# EAGLE design MilliToney (EAGLE 7.5.0)
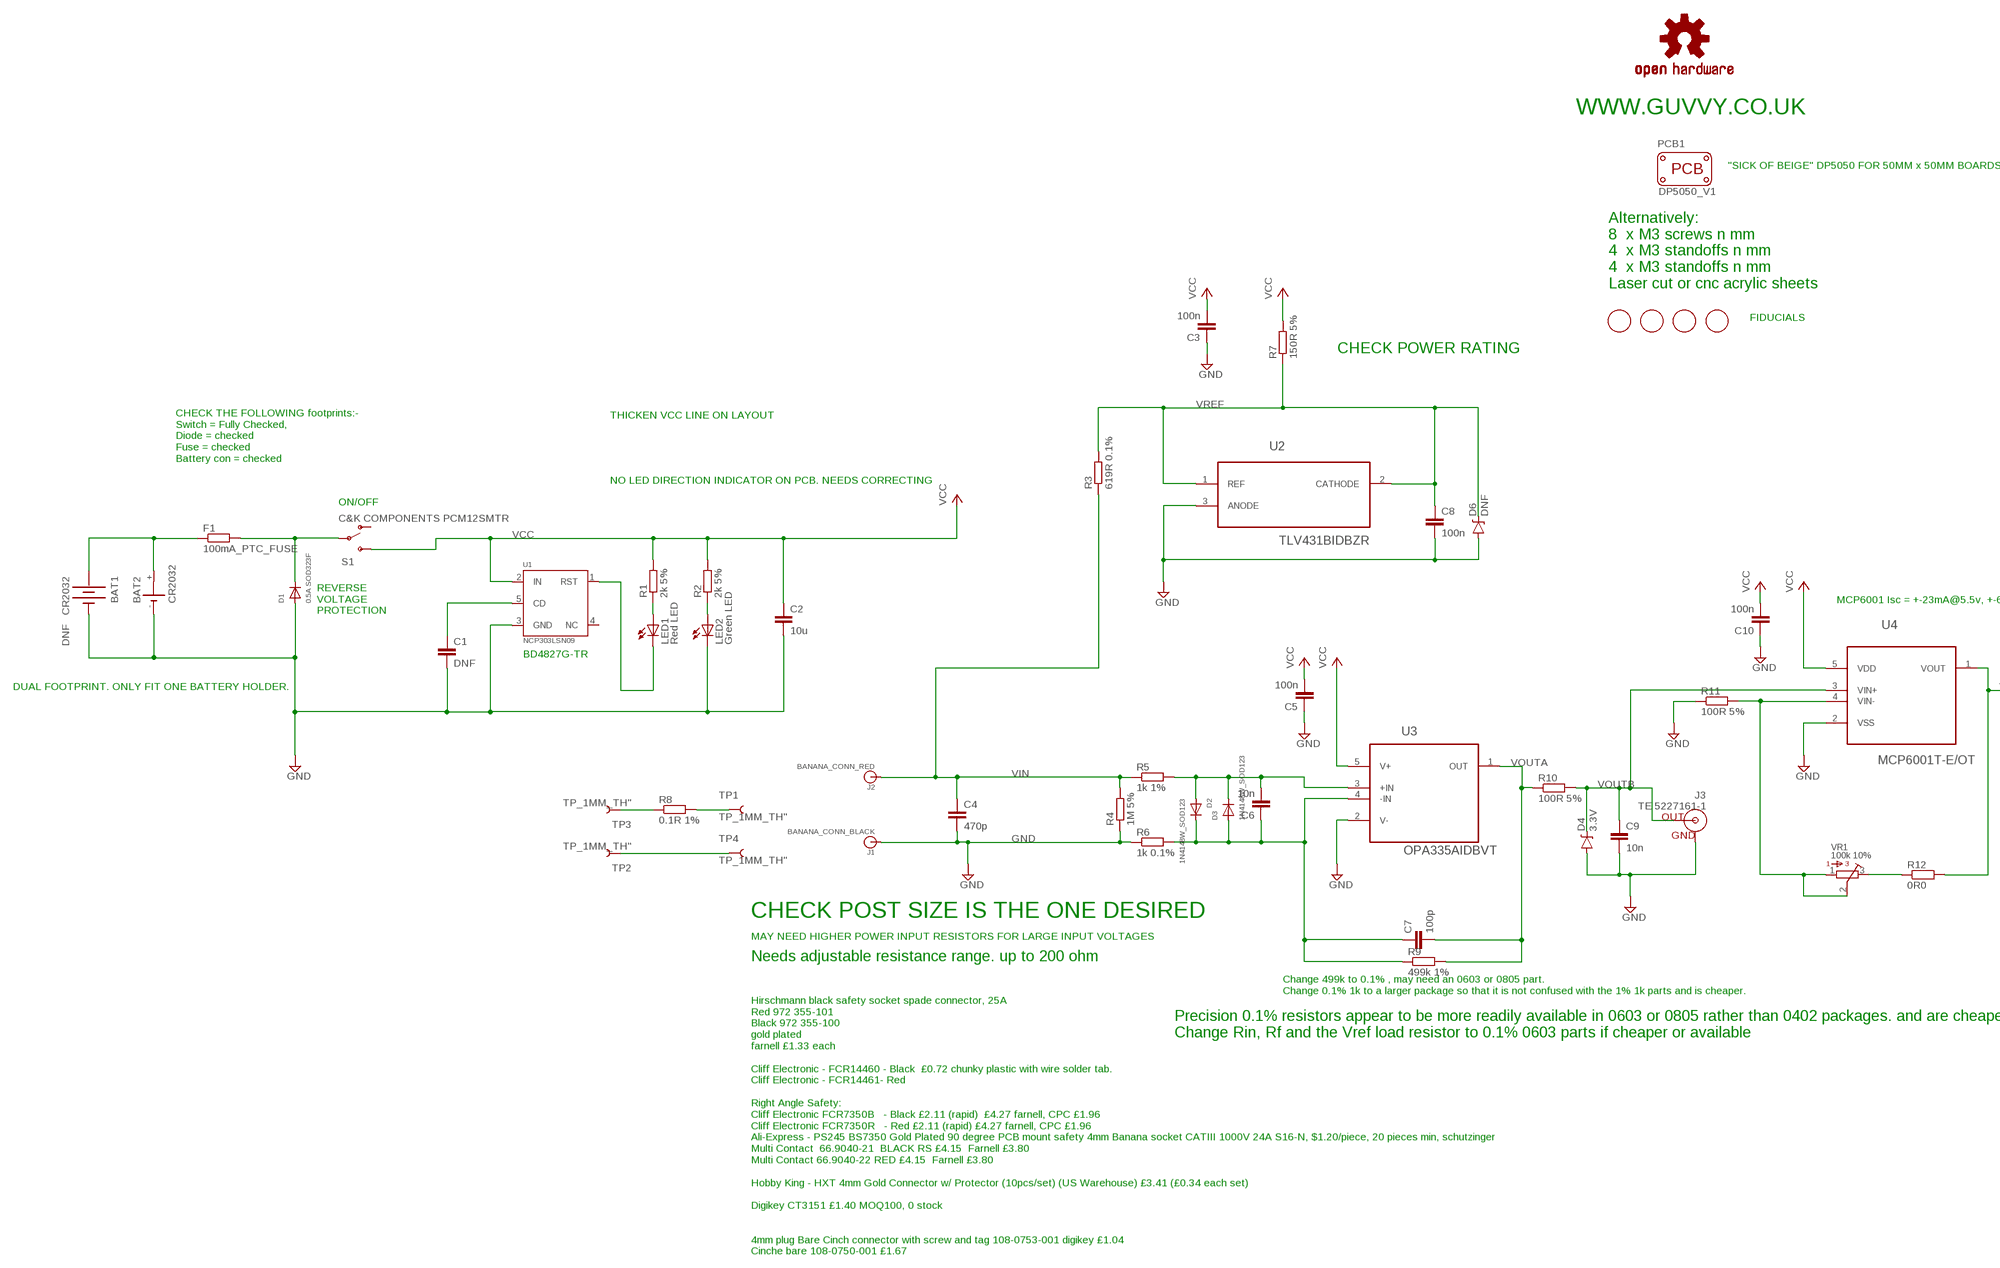
[diagram p0: schematic, sheet 1, part 1 of 2]
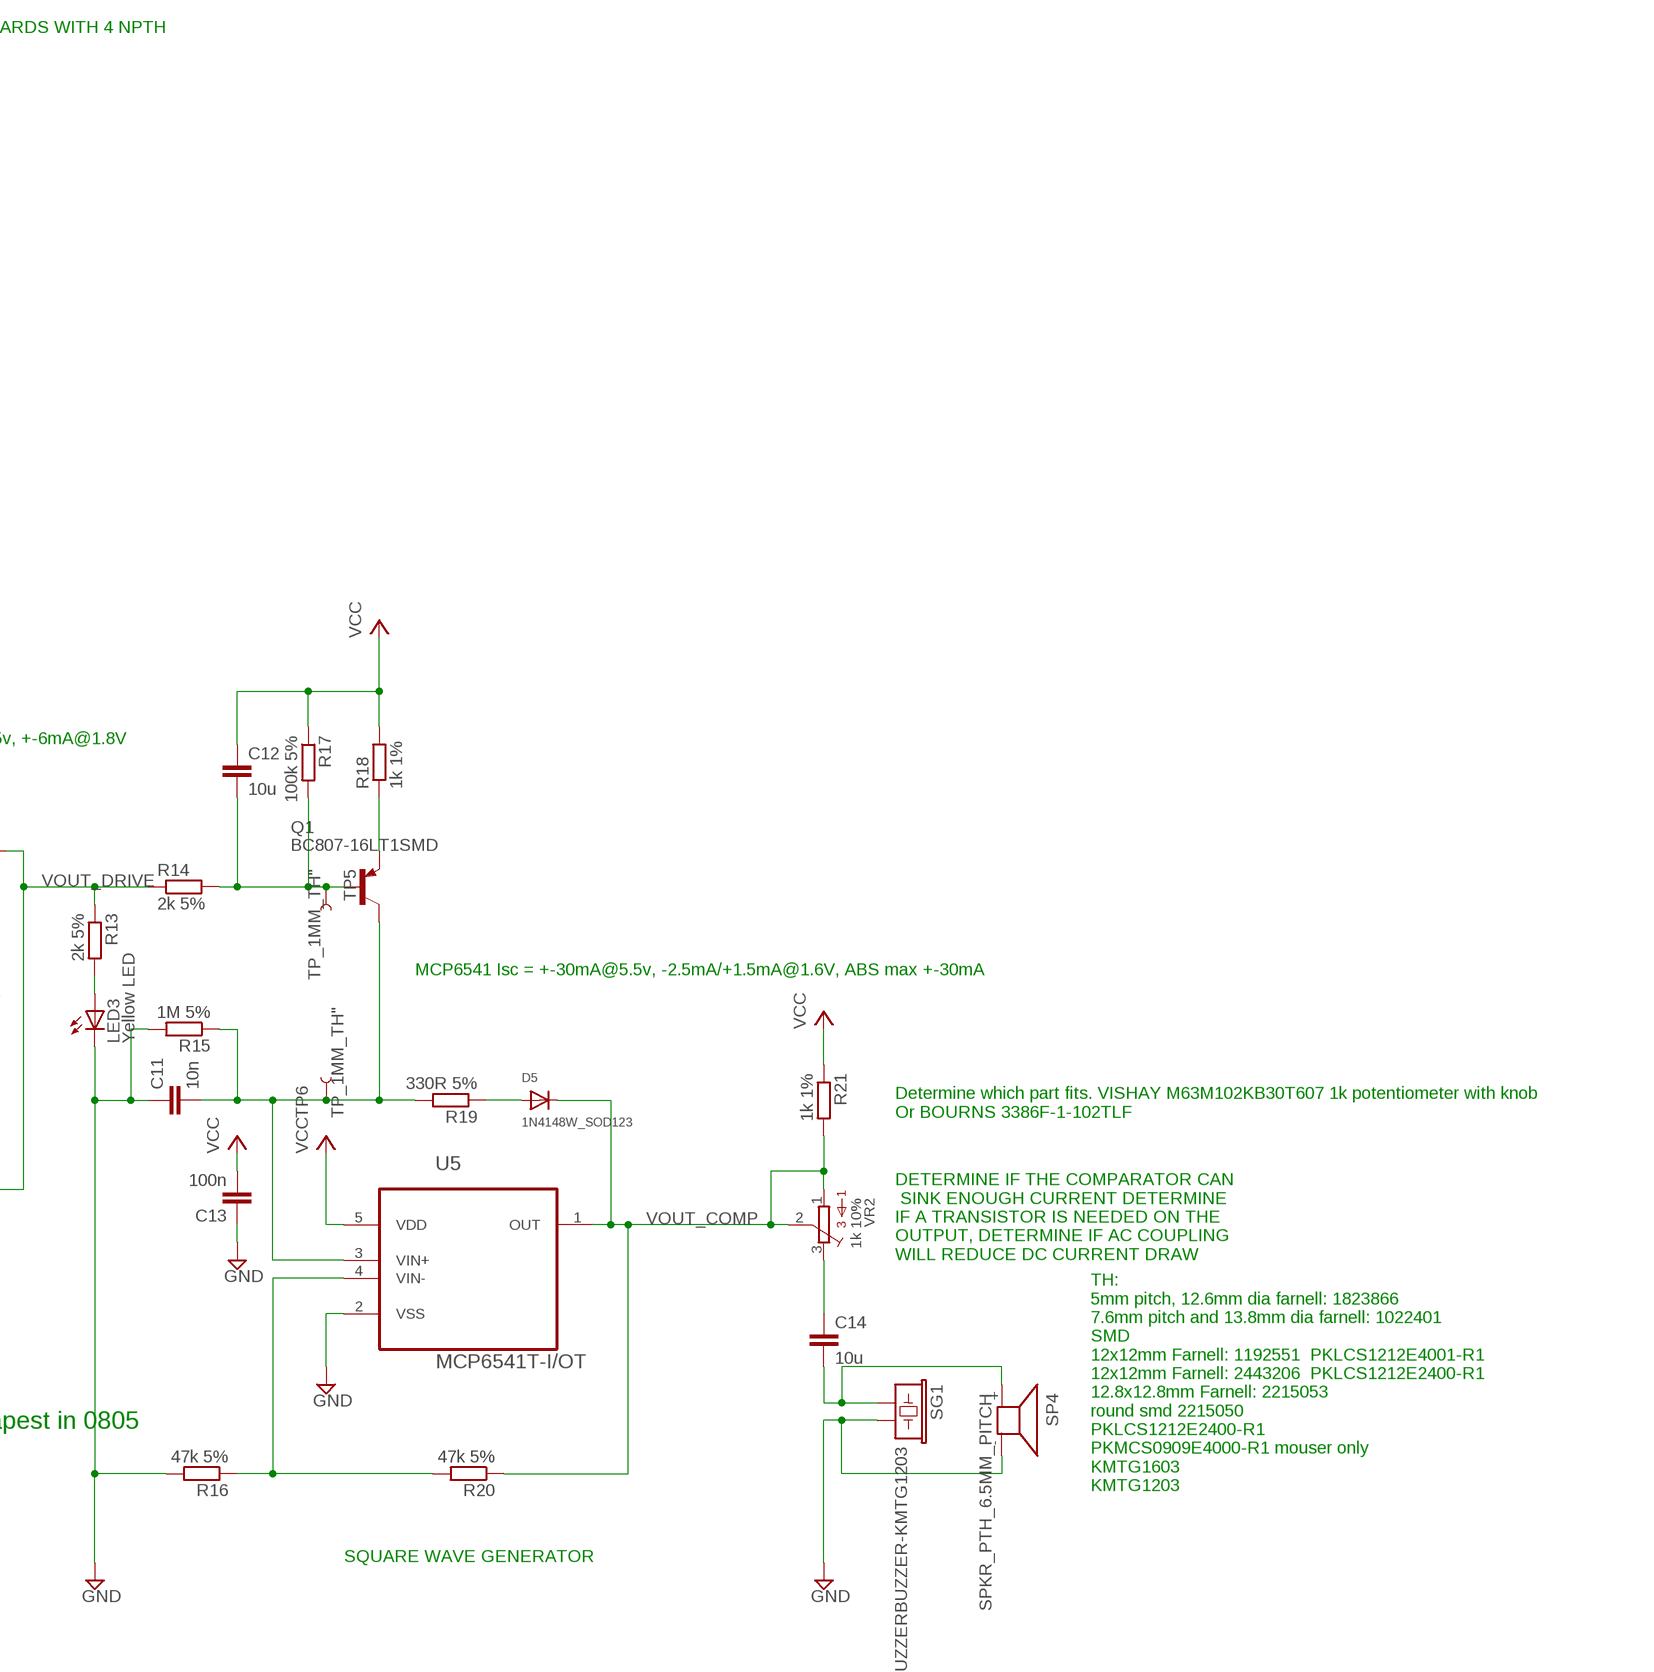
[diagram p1: schematic, sheet 1, part 2 of 2]

## Parts
BAT1  DNF CR2032  BATTERYFOB  [BATTERY_20MM_PTH_COMPACT]
BAT2  CR2032  2032  [KZH20SMD]
C1  DNF  C-EUC0402K  [C0402K]
C2  10u  C-EUC0603  [C0603]
C3  100n  C-EUC0402K  [C0402K]
C4  470p  C-EUC0402K  [C0402K]
C5  100n  C-EUC0402K  [C0402K]
C6  10n  C-EUC0402K  [C0402K]
C7  100p  C-EUC0402K  [C0402K]
C8  100n  C-EUC0402K  [C0402K]
C9  10n  C-EUC0402K  [C0402K]
C10  100n  C-EUC0402K  [C0402K]
C11  10n  C-EUC0402K  [C0402K]
C12  10u  C-EUC0603  [C0603]
C13  100n  C-EUC0402K  [C0402K]
C14  10u  C-EUC0603K  [C0603K]
D1  0.5A SOD323F  DIODESOD-323F  [SOD-323F]
D2  1N4148W_SOD123  DIODE_SOD-123FL  [SOD-123FL]
D3  1N4148W_SOD123  DIODE_SOD-123FL  [SOD-123FL]
D4  3.3V  DIODE-ZENER3.3V  [SOD-323]
D5  1N4148W_SOD123  DIODE_SOD-123FL  [SOD-123FL]
D6  DNF  DIODE-ZENER3.3V  [SOD-323]
F1  100mA_PTC_FUSE  R-EU_R0805  [R0805]
FID1  FIDUCIAL  [FIDUCIAL_1MM]
FID2  FIDUCIAL  [FIDUCIAL_1MM]
FID3  FIDUCIAL  [FIDUCIAL_1MM]
FID4  FIDUCIAL  [FIDUCIAL_1MM]
J1  BANANA_CONN_BLACK  BANANA_CONN  [BANANA_CONN]
J2  BANANA_CONN_RED  BANANA_CONN  [BANANA_CONN]
J3  TE 5227161-1  BNCPTH  [BNC]
LED1  Red LED  LEDSML0603  [SML0603]
LED2  Green LED  LEDSML0603  [SML0603]
LED3  Yellow LED  LEDSML0603  [SML0603]
LOGO1  OSHW-LOGOL  [OSHW-LOGO-L]
PCB1  PCB_DP_SQUARE-5X5  [DP5050_V1]
Q1  BC807-16LT1SMD  [SOT23-BEC]
R1  2k 5%  R-EU_R0402  [R0402]
R2  2k 5%  R-EU_R0402  [R0402]
R3  619R 0.1%  R-EU_R0402  [R0402]
R4  1M 5%  R-EU_R0402  [R0402]
R5  1k 1%  R-EU_R0402  [R0402]
R6  1k 0.1%  R-EU_R0402  [R0402]
R7  150R 5%  R-EU_R0402  [R0402]
R8  0.1R 1%  R-EU_R0603  [R0603]
R9  499k 1%  R-EU_R0402  [R0402]
R10  100R 5%  R-EU_R0402  [R0402]
R11  100R 5%  R-EU_R0402  [R0402]
R12  0R0  R-EU_R0402  [R0402]
R13  2k 5%  R-EU_R0402  [R0402]
R14  2k 5%  R-EU_R0402  [R0402]
R15  1M 5%  R-EU_R0402  [R0402]
R16  47k 5%  R-EU_R0402  [R0402]
R17  100k 5%  R-EU_R0402  [R0402]
R18  1k 1%  R-EU_R0402  [R0402]
R19  330R 5%  R-EU_R0402  [R0402]
R20  47k 5%  R-EU_R0402  [R0402]
R21  1k 1%  R-EU_R0402  [R0402]
S1  C&K COMPONENTS PCM12SMTR  SWITCH-SPDT-SMD-A  [SWITCH-SPST-SMD-A]
SG1  BUZZERBUZZER-KMTG1203  [BUZZER-KMTG1203]
SP4  SPKR_PTH_6.5MM_PITCH  KSS1201  [KSS1201]
TP1  TP_1MM_TH"  [TP_1MM_TH]
TP2  TP_1MM_TH"  [TP_1MM_TH]
TP3  TP_1MM_TH"  [TP_1MM_TH]
TP4  TP_1MM_TH"  [TP_1MM_TH]
TP5  TP_1MM_TH"  [TP_1MM_TH]
TP6  TP_1MM_TH"  [TP_1MM_TH]
U1  NCP303LSN09  [SOT23-5]
U2  TLV431BIDBZR  [SOT95P237X112-3N]
U3  OPA335AIDBVT  [SOT95P280X145-5N]
U4  MCP6001T-E/OT  [SOT95P270X145-5N]
U5  MCP6541T-I/OT  [SOT95P290X145-5N]
VR1  100k 10%  3386-F  [3386F]
VR2  1k 10%  3386-F  [3386F]

## Nets
GND: BAT1.2(-) BAT2.- C1.2 C2.2 C3.1 C4.2 C5.1 C8.2 C9.2 C10.1 C11.1 C13.1 D1.A D4.A D6.A J1.P$1 J3.GND LED2.C LED3.C R4.1 R6.1 R11.1 R15.2 R16.2 SG1.2 SP4.- U1.3(GND) U2.3(ANODE) U3.2(V-) U4.2(VSS) U5.2(VSS)
N$1: BAT1.1(+) BAT2.+ F1.1
N$3: C14.2 SG1.1 SP4.+
N$5: R8.1 TP3.P$1
N$6: C6.2 D2.A D3.C R5.2 U3.3(+IN)
N$7: TP2.P$1 TP4.P$1
N$8: D5.A R19.1
N$9: C6.1 C7.1 D2.C D3.A R6.2 R9.1 U3.4(-IN)
N$11: R12.1 VR1.3
N$14: R11.2 U4.4(VIN-) VR1.1 VR1.2
N$16: LED1.C U1.1(RST)
N$17: C12.2 Q1.B R14.2 R17.2 TP5.P$1
N$18: Q1.E R18.1
N$19: D1.C F1.2 S1.2(P)
N$20: C1.1 U1.5(CD)
N$21: R16.1 R20.2 U5.4(VIN-)
N$22: C14.1 VR2.3
N$23: LED3.A R13.2
N$24: C11.2 Q1.C R15.1 R19.2 TP6.P$1 U5.3(VIN+)
N$26: LED1.A R1.1
N$27: R8.2 TP1.P$1
N$30: LED2.A R2.1
VCC: C2.1 C3.2 C5.2 C10.2 C12.1 C13.2 R1.2 R2.2 R7.2 R17.1 R18.2 R21.1 S1.3(S) U1.2(IN) U3.5(V+) U4.5(VDD) U5.5(VDD)
VIN: C4.1 J2.P$1 R3.1 R4.2 R5.1
VOUT_COMP: D5.C R20.1 R21.2 U5.1(OUT) VR2.1 VR2.2
VOUT_DRIVE: R12.2 R13.1 R14.1 U4.1(VOUT)
VOUTA: C7.2 R9.2 R10.1 U3.1(OUT)
VOUTB: C9.1 D4.C J3.S(OUT) R10.2 U4.3(VIN+)
VREF: C8.1 D6.C R3.2 R7.1 U2.1(REF) U2.2(CATHODE)
Unconnected: S1.1(O) U1.4(NC)

## Notes on the sheet
- WWW.GUVVY.CO.UK
- "SICK OF BEIGE" DP5050 FOR 50MM x 50MM BOARDS WITH 4 NPTH
- Alternatively:
  8  x M3 screws n mm
  4  x M3 standoffs n mm
  4  x M3 standoffs n mm
  Laser cut or cnc acrylic sheets
- FIDUCIALS
- CHECK POWER RATING
- THICKEN VCC LINE ON LAYOUT
- CHECK THE FOLLOWING footprints:- 
  Switch = Fully Checked, 
  Diode = checked
  Fuse = checked
  Battery con = checked
- NO LED DIRECTION INDICATOR ON PCB. NEEDS CORRECTING
- ON/OFF
- MCP6001 Isc = +-23mA@5.5v, +-6mA@1.8V
- REVERSE
  VOLTAGE
  PROTECTION
- BD4827G-TR
- DUAL FOOTPRINT. ONLY FIT ONE BATTERY HOLDER.
- MCP6541 Isc = +-30mA@5.5v, -2.5mA/+1.5mA@1.6V, ABS max +-30mA
- Determine which part fits. VISHAY M63M102KB30T607 1k potentiometer with knob
  Or BOURNS 3386F-1-102TLF
- CHECK POST SIZE IS THE ONE DESIRED
- DETERMINE IF THE COMPARATOR CAN
   SINK ENOUGH CURRENT DETERMINE 
  IF A TRANSISTOR IS NEEDED ON THE 
  OUTPUT, DETERMINE IF AC COUPLING 
  WILL REDUCE DC CURRENT DRAW
- MAY NEED HIGHER POWER INPUT RESISTORS FOR LARGE INPUT VOLTAGES
- Needs adjustable resistance range. up to 200 ohm
- Change 499k to 0.1% , may need an 0603 or 0805 part. 
  Change 0.1% 1k to a larger package so that it is not confused with the 1% 1k parts and is cheaper.
- Precision 0.1% resistors appear to be more readily available in 0603 or 0805 rather than 0402 packages. and are cheapest in 0805
  Change Rin, Rf and the Vref load resistor to 0.1% 0603 parts if cheaper or available
- TH: 
  5mm pitch, 12.6mm dia farnell: 1823866
  7.6mm pitch and 13.8mm dia farnell: 1022401
  SMD
  12x12mm Farnell: 1192551  PKLCS1212E4001-R1
  12x12mm Farnell: 2443206  PKLCS1212E2400-R1
  12.8x12.8mm Farnell: 2215053
  round smd 2215050
  PKLCS1212E2400-R1
  PKMCS0909E4000-R1 mouser only
  KMTG1603
  KMTG1203
- SQUARE WAVE GENERATOR
- Hirschmann black safety socket spade connector, 25A
  Red 972 355-101
  Black 972 355-100
  gold plated
  farnell £1.33 each 
  
  Cliff Electronic - FCR14460 - Black  £0.72 chunky plastic with wire solder tab.
  Cliff Electronic - FCR14461- Red
  
  Right Angle Safety: 
  Cliff Electronic FCR7350B   - Black £2.11 (rapid)  £4.27 farnell, CPC £1.96
  Cliff Electronic FCR7350R   - Red £2.11 (rapid) £4.27 farnell, CPC £1.96
  Ali-Express - PS245 BS7350 Gold Plated 90 degree PCB mount safety 4mm Banana socket CATIII 1000V 24A S16-N, $1.20/piece, 20 pieces min, schutzinger
  Multi Contact  66.9040-21  BLACK RS £4.15  Farnell £3.80
  Multi Contact 66.9040-22 RED £4.15  Farnell £3.80
  
  Hobby King - HXT 4mm Gold Connector w/ Protector (10pcs/set) (US Warehouse) £3.41 (£0.34 each set) 
  
  Digikey CT3151 £1.40 MOQ100, 0 stock
  
  
  4mm plug Bare Cinch connector with screw and tag 108-0753-001 digikey £1.04
  Cinche bare 108-0750-001 £1.67

## Library data of the parts
BAT1 = SparkFun-Electromechanical:BATTERY: Battery Holders Various common sizes : AA, AAA, 18650 (PRT-12895), 20mm coin cell and 12mm coin cell. 20MM_4LEGS, BATT-10373; OC_FARNELL: unknown
BAT2 = kzh20_lithium_batterie_holder:2032; MF: RENATA; MPN: SMTU 2032-LF; OC_FARNELL: 1216354
C1 C4 C6 C7 C9 C11 = rcl:C-EU: CAPACITOR, European symbol; OC_FARNELL: unknown
C2 C12 C14 = rcl:C-EU: CAPACITOR, European symbol; MF: MURATA; MPN: GRM188R61A106ME69D; OC_FARNELL: 2456110
C3 C5 C8 C10 C13 = rcl:C-EU: CAPACITOR, European symbol; MF: MULTICOMP; MPN: MC0402X104K100CT; OC_FARNELL: 1759380
D1 = adafruit:DIODE: Diode SMADIODE - SMA Surface Mount Package 20V 1A Schottky Diode Digikey: 641-1014-6-ND DO-1N4148 - Through Hole Small Current Diode SOD-123 20V 1 A (.5mV Vf) Schottky Diode - Digikey: MBRX120TPMSCT-ND SOD-323 10V 570mA (.38mV Vf, 3ns) Schottky Diode - Digikey: ZLLS410CT-ND SOD-523 30V 30mA Schottky Diode (RB751S-40TE61) - Digikey: RB751S-40TE61CT-ND SOT23-R/W - SOT23 Package (R = Solder Paste/Reflow Ovens, W = Hand-Soldering) BAT54Film 40V 300mA - Digikey: 497-7162-1-ND; MF: NXP; MPN: PMEG3010EJ,115; OC_FARNELL: 1757770
D2 D3 D5 = adafruit:DIODE: Diode SMADIODE - SMA Surface Mount Package 20V 1A Schottky Diode Digikey: 641-1014-6-ND DO-1N4148 - Through Hole Small Current Diode SOD-123 20V 1 A (.5mV Vf) Schottky Diode - Digikey: MBRX120TPMSCT-ND SOD-323 10V 570mA (.38mV Vf, 3ns) Schottky Diode - Digikey: ZLLS410CT-ND SOD-523 30V 30mA Schottky Diode (RB751S-40TE61) - Digikey: RB751S-40TE61CT-ND SOT23-R/W - SOT23 Package (R = Solder Paste/Reflow Ovens, W = Hand-Soldering) BAT54Film 40V 300mA - Digikey: 497-7162-1-ND; MF: MULTICOMP; MPN: 1N4148W; OC_FARNELL: 1621821
D4 = SparkFun-DiscreteSemi:DIODE-ZENER: Zener Diode Production Part - 8199 3.4V Zener Voltage; OC_FARNELL: unknown; PROD_ID: DIO-11284
D6 = SparkFun-DiscreteSemi:DIODE-ZENER: Zener Diode Production Part - 8199 3.4V Zener Voltage; OC_FARNELL: unknown; PROD_ID: DIO-11284; VALUE: 3.3V
F1 = rcl:R-EU_: RESISTOR, European symbol; MF: BOURNS; MPN: MF-PSMF010X-2; OC_FARNELL: 1294873
FID1-FID4 = adafruit:FIDUCIAL: For use by pick and place machines to calibrate the vision/machine, 1mm By microbuilder.eu; OC_FARNELL: unknown
J1 = SparkFun-Connectors:BANANA_CONN: Through-hole banana jack; MF: CLIFF ELECTRONIC COMPONENTS; MPN: FCR14460; OC_FARNELL: 2392747
J2 = SparkFun-Connectors:BANANA_CONN: Through-hole banana jack; MF: CLIFF ELECTRONIC COMPONENTS; MPN: FCR14461; OC_FARNELL: 2392748
J3 = SparkFun-Connectors:BNC: BNC Connector, Mouser Part# 5227161; MF: TE CONNECTIVITY / AMP; MPN: 5227161-1; OC_FARNELL: 1338762
LED1 = led:LED: LED OSRAM: - CHIPLED LG R971, LG N971, LY N971, LG Q971, LY Q971, LO R971, LY R971 LH N974, LH R974 LS Q976, LO Q976, LY Q976 LO Q996 - Hyper CHIPLED LW Q18S LB Q993, LB Q99A, LB R99A - SideLED LS A670, LO A670, LY A670, LG A670, LP A670 LB A673, LV A673, LT A673, LW A673 LH A674 LY A675 LS A676, LA A676, LO A676, LY A676, LW A676 LS A679, LY A679, LG A679 - Hyper Micro SIDELED® LS Y876, LA Y876, LO Y876, LY Y876 LT Y87S - SmartLED LW L88C, LW L88S LB L89C, LB L89S, LG L890 LS L89K, LO L89K, LY L89K LS L896, LA L896, LO L896, LY L896 - TOPLED LS T670, LO T670, LY T670, LG T670, LP T670 LSG T670, LSP T670, LSY T670, LOP T670, LYG T670 LG T671, LOG T671, LSG T671 LB T673, LV T673, LT T673, LW T673 LH T674 LS T676, LA T676, LO T676, LY T676, LB T676, LH T676, LSB T676, LW T676 LB T67C, LV T67C, LT T67C, LS T67K, LO T67K, LY T67K, LW E67C LS E67B, LA E67B, LO E67B, LY E67B, LB E67C, LV E67C, LT E67C LW T67C LS T679, LY T679, LG T679 LS T770, LO T770, LY T770, LG T770, LP T770 LB T773, LV T773, LT T773, LW T773 LH T774 LS E675, LA E675, LY E675, LS T675 LS T776, LA T776, LO T776, LY T776, LB T776 LHGB T686 LT T68C, LB T68C - Hyper Mini TOPLED® LB M676 - Mini TOPLED Santana® LG M470 LS M47K, LO M47K, LY M47K Source: http://www.osram.convergy.de LUXEON: - LUMILED® LXK2-PW12-R00, LXK2-PW12-S00, LXK2-PW14-U00, LXK2-PW14-V00 LXK2-PM12-R00, LXK2-PM12-S00, LXK2-PM14-U00 LXK2-PE12-Q00, LXK2-PE12-R00, LXK2-PE12-S00, LXK2-PE14-T00, LXK2-PE14-U00 LXK2-PB12-K00, LXK2-PB12-L00, LXK2-PB12-M00, LXK2-PB14-N00, LXK2-PB14-P00, LXK2-PB14-Q00 LXK2-PR12-L00, LXK2-PR12-M00, LXK2-PR14-Q00, LXK2-PR14-R00 LXK2-PD12-Q00, LXK2-PD12-R00, LXK2-PD12-S00 LXK2-PH12-R00, LXK2-PH12-S00 LXK2-PL12-P00, LXK2-PL12-Q00, LXK2-PL12-R00 Source: www.luxeon.com KINGBRIGHT: KA-3528ASYC Source: www.kingbright.com; MF: KINGBRIGHT; MPN: KP-1608SURCK; OC_FARNELL: 2290329
LED2 = led:LED: LED OSRAM: - CHIPLED LG R971, LG N971, LY N971, LG Q971, LY Q971, LO R971, LY R971 LH N974, LH R974 LS Q976, LO Q976, LY Q976 LO Q996 - Hyper CHIPLED LW Q18S LB Q993, LB Q99A, LB R99A - SideLED LS A670, LO A670, LY A670, LG A670, LP A670 LB A673, LV A673, LT A673, LW A673 LH A674 LY A675 LS A676, LA A676, LO A676, LY A676, LW A676 LS A679, LY A679, LG A679 - Hyper Micro SIDELED® LS Y876, LA Y876, LO Y876, LY Y876 LT Y87S - SmartLED LW L88C, LW L88S LB L89C, LB L89S, LG L890 LS L89K, LO L89K, LY L89K LS L896, LA L896, LO L896, LY L896 - TOPLED LS T670, LO T670, LY T670, LG T670, LP T670 LSG T670, LSP T670, LSY T670, LOP T670, LYG T670 LG T671, LOG T671, LSG T671 LB T673, LV T673, LT T673, LW T673 LH T674 LS T676, LA T676, LO T676, LY T676, LB T676, LH T676, LSB T676, LW T676 LB T67C, LV T67C, LT T67C, LS T67K, LO T67K, LY T67K, LW E67C LS E67B, LA E67B, LO E67B, LY E67B, LB E67C, LV E67C, LT E67C LW T67C LS T679, LY T679, LG T679 LS T770, LO T770, LY T770, LG T770, LP T770 LB T773, LV T773, LT T773, LW T773 LH T774 LS E675, LA E675, LY E675, LS T675 LS T776, LA T776, LO T776, LY T776, LB T776 LHGB T686 LT T68C, LB T68C - Hyper Mini TOPLED® LB M676 - Mini TOPLED Santana® LG M470 LS M47K, LO M47K, LY M47K Source: http://www.osram.convergy.de LUXEON: - LUMILED® LXK2-PW12-R00, LXK2-PW12-S00, LXK2-PW14-U00, LXK2-PW14-V00 LXK2-PM12-R00, LXK2-PM12-S00, LXK2-PM14-U00 LXK2-PE12-Q00, LXK2-PE12-R00, LXK2-PE12-S00, LXK2-PE14-T00, LXK2-PE14-U00 LXK2-PB12-K00, LXK2-PB12-L00, LXK2-PB12-M00, LXK2-PB14-N00, LXK2-PB14-P00, LXK2-PB14-Q00 LXK2-PR12-L00, LXK2-PR12-M00, LXK2-PR14-Q00, LXK2-PR14-R00 LXK2-PD12-Q00, LXK2-PD12-R00, LXK2-PD12-S00 LXK2-PH12-R00, LXK2-PH12-S00 LXK2-PL12-P00, LXK2-PL12-Q00, LXK2-PL12-R00 Source: www.luxeon.com KINGBRIGHT: KA-3528ASYC Source: www.kingbright.com; MF: KINGBRIGHT; MPN: KP-1608CGCK; OC_FARNELL: 2290328
LED3 = led:LED: LED OSRAM: - CHIPLED LG R971, LG N971, LY N971, LG Q971, LY Q971, LO R971, LY R971 LH N974, LH R974 LS Q976, LO Q976, LY Q976 LO Q996 - Hyper CHIPLED LW Q18S LB Q993, LB Q99A, LB R99A - SideLED LS A670, LO A670, LY A670, LG A670, LP A670 LB A673, LV A673, LT A673, LW A673 LH A674 LY A675 LS A676, LA A676, LO A676, LY A676, LW A676 LS A679, LY A679, LG A679 - Hyper Micro SIDELED® LS Y876, LA Y876, LO Y876, LY Y876 LT Y87S - SmartLED LW L88C, LW L88S LB L89C, LB L89S, LG L890 LS L89K, LO L89K, LY L89K LS L896, LA L896, LO L896, LY L896 - TOPLED LS T670, LO T670, LY T670, LG T670, LP T670 LSG T670, LSP T670, LSY T670, LOP T670, LYG T670 LG T671, LOG T671, LSG T671 LB T673, LV T673, LT T673, LW T673 LH T674 LS T676, LA T676, LO T676, LY T676, LB T676, LH T676, LSB T676, LW T676 LB T67C, LV T67C, LT T67C, LS T67K, LO T67K, LY T67K, LW E67C LS E67B, LA E67B, LO E67B, LY E67B, LB E67C, LV E67C, LT E67C LW T67C LS T679, LY T679, LG T679 LS T770, LO T770, LY T770, LG T770, LP T770 LB T773, LV T773, LT T773, LW T773 LH T774 LS E675, LA E675, LY E675, LS T675 LS T776, LA T776, LO T776, LY T776, LB T776 LHGB T686 LT T68C, LB T68C - Hyper Mini TOPLED® LB M676 - Mini TOPLED Santana® LG M470 LS M47K, LO M47K, LY M47K Source: http://www.osram.convergy.de LUXEON: - LUMILED® LXK2-PW12-R00, LXK2-PW12-S00, LXK2-PW14-U00, LXK2-PW14-V00 LXK2-PM12-R00, LXK2-PM12-S00, LXK2-PM14-U00 LXK2-PE12-Q00, LXK2-PE12-R00, LXK2-PE12-S00, LXK2-PE14-T00, LXK2-PE14-U00 LXK2-PB12-K00, LXK2-PB12-L00, LXK2-PB12-M00, LXK2-PB14-N00, LXK2-PB14-P00, LXK2-PB14-Q00 LXK2-PR12-L00, LXK2-PR12-M00, LXK2-PR14-Q00, LXK2-PR14-R00 LXK2-PD12-Q00, LXK2-PD12-R00, LXK2-PD12-S00 LXK2-PH12-R00, LXK2-PH12-S00 LXK2-PL12-P00, LXK2-PL12-Q00, LXK2-PL12-R00 Source: www.luxeon.com KINGBRIGHT: KA-3528ASYC Source: www.kingbright.com; MF: KINGBRIGHT; MPN: KP-1608SYCK; OC_FARNELL: 2290330
LOGO1 = SparkFun-Aesthetics:OSHW-LOGO: Open Source Hardware Logo This logo indicates the piece of hardware it is found on incorporates a OSHW license and/or adheres to the definition of open source hardware found here: http://freedomdefined.org/OSHW; OC_FARNELL: unknown
PCB1 = dp_devices:PCB_DP_SQUARE: Dangerous Prototypes Standard Square PCB sizes; OC_FARNELL: unknown; PCB_SIZE: DP5050_V1
Q1 = transistor-pnp:BC807*: PNP Transistror; MF: ON SEMICONDUCTOR; MPN: BC807-16LT1G; OC_FARNELL: 2317586
R1 R2 R4 R5 R7 R10-R21 = rcl:R-EU_: RESISTOR, European symbol; OC_FARNELL: unknown
R3 = rcl:R-EU_: RESISTOR, European symbol; MF: TE CONNECTIVITY; MPN: CPF0402B619RE1; OC_FARNELL: 2330768
R6 = rcl:R-EU_: RESISTOR, European symbol; MF: WELWYN; MPN: PCF0402-R-1K-B-T1.; OC_FARNELL: 1108781
R8 = rcl:R-EU_: RESISTOR, European symbol; MF: PANASONIC ELECTRONIC COMPONENTS; MPN: ERJ3RSFR10V; OC_FARNELL: 1717759
R9 = rcl:R-EU_: RESISTOR, European symbol; MF: PANASONIC ELECTRONIC COMPONENTS; MPN: ERJ3EKF4993V; OC_FARNELL: 2303291
S1 = SparkFun-Electromechanical:SWITCH-SPDT: SPDT Switch Simple slide switch, Spark Fun Electronics SKU : COM-00102 DPDT SMT slide switch, AYZ0202, SWCH-08179; MF: C & K COMPONENTS; MPN: PCM12SMTR; OC_FARNELL: 9575146
SG1 = KMTG1203:BUZZER: Buzzer 12mm Comp-Buzzer; MF: KINGSTATE; MPN: KMTG1203; OC_FARNELL: 2215052
SP4 = buzzer:KSS1201: SPEAKER Source: Schukat; OC_FARNELL: unknown; OC_NEWARK: unknown
TP1-TP6 = TP_1MM_TH:TP_1MM_TH: Bare copper test points for troubleshooting or ICT; OC_FARNELL: unknown
U1 = SparkFun-DigitalIC:NCP303LSN09: Power-on uC reset controller; MF: ROHM; MPN: BD4827G-TR; OC_FARNELL: 2343050
U2 = TLV431:TLV431BIDBZR: LOW-VOLTAGE ADJUSTABLE PRECISION SHUNT REGULATOR; MF: TEXAS INSTRUMENTS; MPN: TLV431BCDBZTG4; OC_FARNELL: 1053385; OC_NEWARK: 71J8026; PACKAGE: 3-SOT-23; SUPPLIER: TEXAS INSTRUMENTS
U3 = Texas Instruments_By_element14_Batch_1:OPA335AIDBVT: 0.05ìV/°C max, SINGLE-SUPPLY CMOS OPERATIONAL AMPLIFIERS Zerø-Drift Series; MF: TEXAS INSTRUMENTS; MPN: OPA335AIDBVT; OC_FARNELL: 1459586; OC_NEWARK: 36K7582; PACKAGE: SOT-23-5; SUPPLIER: Texas Instruments
U4 = Microchip_By_element14_Batch_1:MCP6001T-E/OT: 1 MHz, Low-Power Op Amp; MF: MICROCHIP; MPN: MCP6001T-E/OT; OC_FARNELL: 1332116; OC_NEWARK: 34M7471; PACKAGE: SOT23-5; SUPPLIER: Microchip
U5 = MCP6541_SOT23-5:MCP6541T-I/OT: IC, Push-Pull Output Sub-Microamp Single Comparators,SOT23-5; MF: MICROCHIP; MPN: MCP6541T-I/OT; OC_FARNELL: 1825063; OC_NEWARK: 12T7776; PACKAGE: SOT23-5; SUPPLIER: Microchip
VR1 = bourns:3386-: 3386 Series 3/8" Square Trimmer; MF: BOURNS; MPN: 3386F-1-104TLF; OC_FARNELL: 9354581
VR2 = bourns:3386-: 3386 Series 3/8" Square Trimmer; MF: BOURNS; MPN: 3386F-1-102TLF; OC_FARNELL: 9354549

## Board
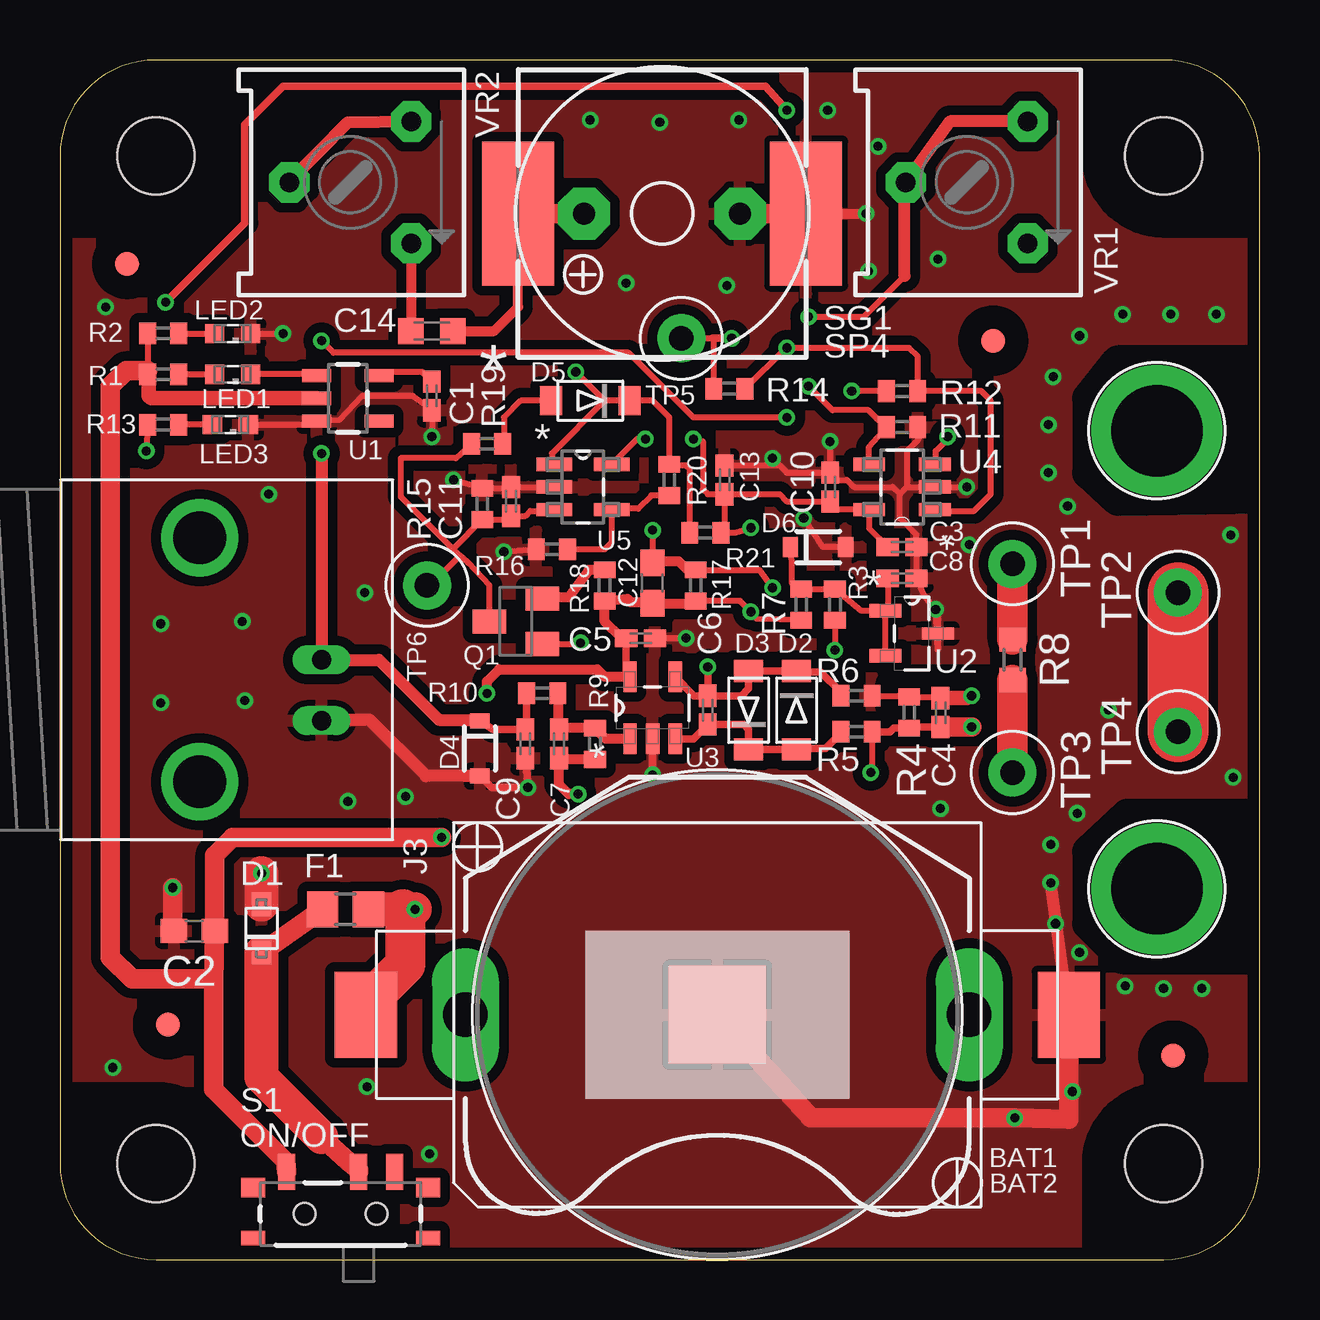
[diagram p2: board, top side]
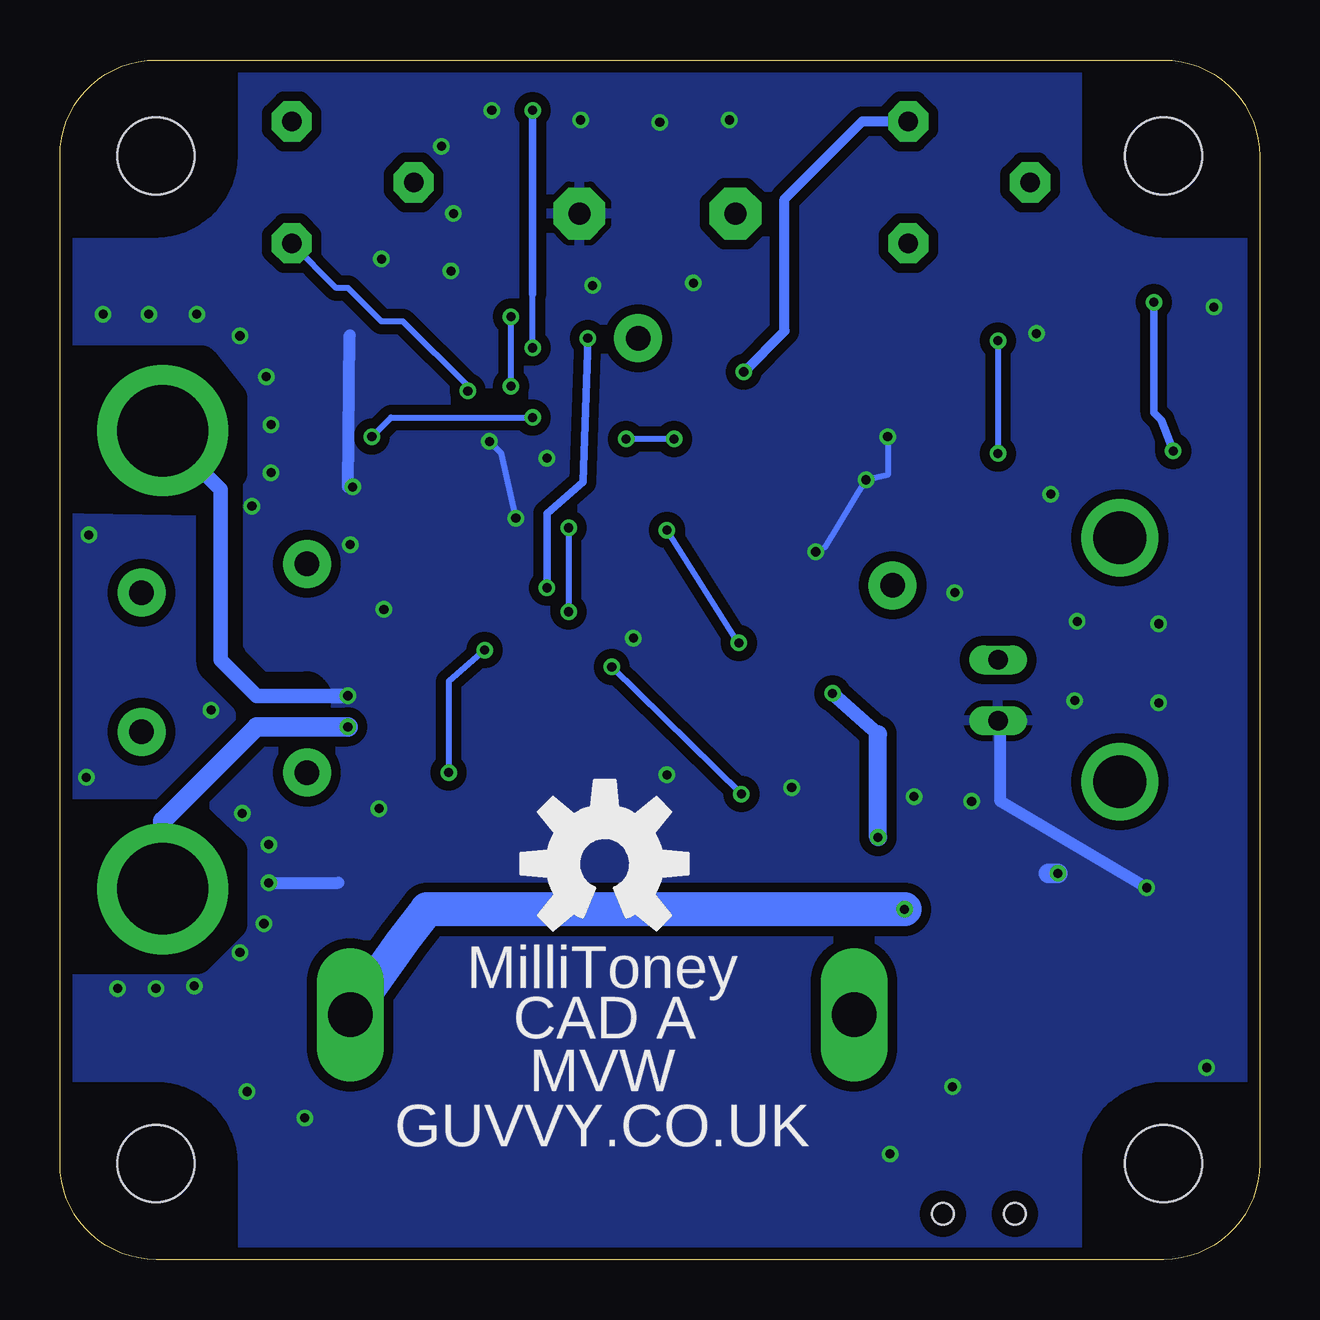
[diagram p3: board, bottom side, seen from below]

Size 50 x 50 mm. Coordinates in mm from the lower left corner, seen from the top.
Copper layers (1*16): Top 0.035mm / dielectric 1.6mm / Bottom 0.035mm
Design rules "Elecrow_2-layer_PCB_eagle_rule": minimum track width 6mil, minimum drill 12mil, track to track 6mil, track to pad 6mil, pad to pad 6mil, via to via 8mil, smd to smd 0mil, copper to edge 20mil, drill to drill 10mil, minimum pad ring 6mil, minimum via ring 6mil, stop-mask expansion 0mil, vias tented up to drill 100mil, thermal gap 10mil
tRestrict: area 42.9,31.7 to 50.2,37.4; area 42.9,12.6 to 49.9,18.5; area 34.9,23.1 to 38.8,23.9
bRestrict: area 42.9,31.7 to 50.2,37.4; area 42.9,12.6 to 49.9,18.5; area 39.6,23.3 to 45.9,34.8

### Footprints (pad centres in the part's own frame; a part is rotated, then mirrored left to right if it is on the bottom)
BATTERY_20MM_PTH_COMPACT = drill 1.854 long: 1 -10.5,0; 3 10.5,0 | smd 4.064 x 4.064: 2 0,0
KZH20SMD = smd 2.6 x 3.6: + 14.65,0; - -14.65,0
C0402K = smd 0.925 x 0.74: 1 -0.6,0; 2 0.6,0
C0603 = smd 1.1 x 1: 1 -0.85,0; 2 0.85,0
C0603K = smd 1.05 x 1.08: 1 -0.875,0; 2 0.875,0
SOD-323F = smd 1 x 0.8: A -1,0; C 1,0
SOD-123FL = smd 0.91 x 1.22: A 1.637,0; C -1.637,0
SOD-323 = smd 0.63 x 0.83: A 1.15,0; C -1.15,0
R0805 = smd 1.3 x 1.5: 1 -0.95,0; 2 0.95,0
FIDUCIAL_1MM = smd 1 x 1: 1 0,0
BANANA_CONN = drill 3.81 pad 5.461: P$1 0,0
BNC = drill 2.2: 3 -5.08,5.08; 4 5.08,5.08 | drill 0.8 long: GND -2.54,0; S 0,0
SML0603 = smd 0.8 x 0.8: A 0.75,0; C -0.75,0
DP5050_V1 = hole 3.2: -21,-21; 21,-21; 21,21; -21,21
SOT23-BEC = smd 1 x 1.4: B -0.95,-1.1; C 0,1.1; E 0.95,-1.1
R0402 = smd 0.7 x 0.9: 1 -0.65,0; 2 0.65,0
R0603 = smd 1 x 1.1: 1 -0.85,0; 2 0.85,0
SWITCH-SPST-SMD-A = smd 0.7 x 1.5: 1 -2.25,-1.75; 2 -0.75,-1.75; 3 2.25,-1.75 | smd 1 x 0.6: GND1 -3.65,1; GND3 3.65,1 | smd 1 x 0.8: GND2 -3.65,-1.1; GND4 3.65,-1.1 | hole 0.9: -1.5,0; 1.5,0
BUZZER-KMTG1203 = smd 3 x 6: 1 -6,0; 2 6,0
KSS1201 = drill 0.914 pad 2.159 octagon: + 3.251,0; - -3.251,0
TP_1MM_TH = drill 1.02 pad 2: P$1 0,0
SOT23-5 = smd 0.55 x 1.2: 1 -0.95,-1.3; 2 0,-1.3; 3 0.95,-1.3; 4 0.95,1.3; 5 -0.95,1.3
SOT95P237X112-3N = smd 1.321 x 0.559: 1 -1.092,0.94; 2 -1.092,-0.94 | smd 1.321 x 0.508: 3 1.092,0
SOT95P280X145-5N = smd 1.27 x 0.559: 1 -1.295,0.94; 2 -1.295,0; 3 -1.295,-0.94; 4 1.295,-0.94; 5 1.295,0.94
SOT95P270X145-5N = smd 1.321 x 0.559: 1 -1.372,0.94; 2 -1.372,0; 3 -1.372,-0.94; 4 1.372,-0.94; 5 1.372,0.94
SOT95P290X145-5N = smd 1.473 x 0.559: 1 -1.194,0.94; 2 -1.194,0; 3 -1.194,-0.94; 4 1.194,-0.94; 5 1.194,0.94
3386F = drill 0.813 pad 1.676 octagon: 1 -2.54,2.54; 2 0,-2.54; 3 2.54,2.54

### Placement (x,y rotation side)
BAT1  27.4,10.2 180 top
BAT2  27.4,10.2 180 top
C1  15.5,36 270 top
C2  5.6,13.7 180 top
C3  35.1,29.7 180 top
C4  36.7,22.8 90 top
C5  24.2,25.9 180 top
C6  27,22.9 270 top
C7  20.8,21.5 90 top
C8  35.1,28.4 0 top
C9  19.4,21.5 270 top
C10  32.1,32.2 270 top
C11  18.8,31.6 270 top
C12  24.7,28.2 90 top
C13  27.7,32.5 270 top
C14  15.5,38.7 0 top
D1  8.4,13.8 270 top
D2  30.7,22.9 270 top
D3  28.7,22.9 90 top
D4  17.5,21.3 270 top
D5  22.1,35.8 180 top
D6  31.6,29.7 0 top
F1  11.9,14.6 180 top
FID1  46.4,8.5 0 top
FID2  4.5,9.8 0 top
FID3  2.8,41.5 0 top
FID4  38.9,38.3 0 top
J1  45.72,34.55 0 top
J2  45.72,15.45 0 top
J3  10.9,25 90 top
LED1  7.2,36.9 180 top
LED2  7.2,38.6 180 top
LED3  7.1,34.8 180 top
LOGO1  27.3,16.5 0 bottom
PCB1  25,25 0 top
Q1  19,26.6 90 top
R1  4.3,36.9 180 top
R2  4.3,38.6 180 top
R3  32.3,27.3 90 top
R4  35.4,22.8 270 top
R5  33.2,22 180 top
R6  33.2,23.5 180 top
R7  30.9,27.3 270 top
R8  39.7,25 90 top
R9  22.3,21.5 90 top
R10  20.1,23.6 180 top
R11  35.1,34.7 180 top
R12  35.1,36.2 0 top
R13  4.3,34.8 0 top
R14  27.9,36.3 180 top
R15  17.6,31.5 90 top
R16  20.5,29.6 180 top
R17  26.5,28.1 90 top
R18  22.7,28.1 270 top
R19  17.8,34 180 top
R20  25.4,32.5 270 top
R21  26.9,30.3 180 top
S1  11.7,1.9 180 top
SG1  25.1,43.6 0 top
SP4  25.1,43.6 180 top
TP1  39.7,29 0 top
TP2  46.6,27.8 0 top
TP3  39.7,20.3 90 top
TP4  46.6,22 0 top
TP5  25.9,38.4 0 top
TP6  15.3,28.1 0 top
U1  12,35.9 270 top
U2  35.5,26.1 0 top
U3  24.7,23 90 top
U4  35.1,32.2 180 top
U5  21.8,32.2 0 top
VR1  37.8,44.9 270 top
VR2  12.1,44.9 270 top

### Tracks (layer width: path | path; a pad name or v marks a point on that pad's centre or on a via)
GND  (via drill 0.38)
  Top 0.254: 17.75,20.1 D4.A | R6.1 34.95,23.5 R4.1 36.65,23.45 C4.2 | R16.2 v18.5,29.5 | v16.4,32.5 17.55,32.2 R15.2 18.75,32.15 C11.1 U5.2 | v36.5,27.1 36.59,25.41 U2.3 36.6,26.9 36,27.7 C8.2 C3.1 35.7,30.2 35,30.9 35,31.9 | C13.1 30,33.1 30.3,32.8 C10.1 | 35,31.9 35.3,32.2 | 35.3,32.2 U4.2 v37.8,32.2 | C10.1 32.4,32.5 32.8,32.5 33.1,32.2 34.7,32.2 35,31.9 | R11.1 35.8,34.95 35.8,34.2 35.3,33.7 35.3,32.2 | C5.1 v26.1,25.9 | v15.5,34.3 C1.2 14.7,36 12.6,36 11.65,35 U1.3 10.65,34.8 LED3.C | LED2.C v9.3,38.6 | D6.A 31.8,29.7 v31,30.9 | v32.1,34.1 C10.1 | v38,23.5 37.8,23.4
  Top 0.305: C9.2 v19.5,19.67 17.98,19.67 D4.A | U3.2 v24.7,20.2
  Top 0.406: SG1.2 v33.6,43.6
  Top 0.508: D4.A 15.25,20.15 12.9,22.5 10.94,22.5 J3.GND | BAT2.- v41.3,15.7
  Top 0.61: 37.8,23.4 C4.2
  Top 0.813: SP4.- SG1.2 | BAT1.2 31.3,5.9 v39.8,5.9 42.05,5.85 BAT2.- | C2.2 4.7,13.7 v4.7,15.5
  Top 1.422: D1.A v8.4,16.1
  Bottom 0.254: v18.5,29.5 18.1,29.7 v16.4,32.5 15.5,32.7 v15.5,34.3 | v37.8,32.2 38,32.2 | v31,30.9 31.6,33.6 v32.1,34.1
  Bottom 0.406: J1.P$1 45.72,34.92
  Bottom 0.508: v4.7,15.5 10.8,19.1 10.8,22.36 J3.GND | v41.3,15.7 38.4,15.7 | 38,32.2 37.92,38.52
  Bottom 0.61: 45.65,34.45 43.3,32.1 43.3,25 41.8,23.5 v38,23.5
  Bottom 0.813: v8.4,16.1 8.8,16.1
  Bottom 1.016: 45.65,34.55 45.65,34.45
  Bottom 1.27: J1.P$1 45.65,34.55
  other vias: 12.7,27.8 41.3,17.3 12,19.1 4.2,26.5 46.3,39.4 34.1,46.4 15.4,4.4 7.7,23.3 7.6,26.6 4.2,23.2 12.8,7.2 2.2,8 41.2,34.8 42.5,38.5 42.2,7 33.7,41.2 27.8,40.6 8.7,31.9 29.7,33.4 14.4,19.3 1.9,39.7 32,47.9 28.3,47.5 22.1,47.5 25,47.4 36.6,41.7 41.5,14 36.7,18.8 47.6,11.3 44.3,39.4 48.2,39.4 41.4,36.8 41.2,32.8 44.4,11.4 43.7,22.9 48.9,20.1 48.8,30.2 42,31.4 42.4,18.6 23.6,40.7 42.5,12.8 46,11.3 37.9,29.8
  pour Top (isolate 0.406): -10.94,-2.74 -10.94,82.35 102.87,82.55 102.87,-2.54
  pour Bottom (isolate 0.406): -8.87,82.08 101.6,81.28 101.6,-2.54 -8.87,-1.74
N$1  (via drill 0.38)
  Top 0.813: BAT2.+ 12.8,10.45 | 13,14.6 F1.1
  Top 1.422: v14.8,14.6 14.3,14.6 13,14.6
  Top 1.676: 12.8,10.45 12.8,10.7 14.4,12.3 14.4,14.5 14.3,14.6
  Bottom 1.422: v14.8,14.6 34.7,14.6 35.7,13.3 BAT1.1
N$3
  Top 0.406: C14.2 18.1,38.7 19.1,39.7 SG1.1
  Top 0.813: SP4.+ SG1.1
N$5
  Top 1.27: R8.1 TP3.P$1
N$6
  Top 0.305: R5.2 32.55,21.95 31.9,21.3 30.74,21.3 D2.A D3.C 28.7,22.1 28.5,22.3 C6.2 26.4,21.7 U3.3
N$7
  Top 2.54: TP2.P$1 TP4.P$1
N$8
  Top 0.254: D5.A 19.2,35.8 18.5,35.1 18.5,34.05 R19.1
N$9  (via drill 0.38)
  Top 0.305: R6.2 32.55,23.65 31.7,24.5 30.74,24.5 D2.C D3.A 28.7,23.8 28.4,23.5 C6.1 | C6.1 26.43,23.5 U3.4 | C6.1 v27,24.7
  Top 0.406: R9.1 20.85,20.85 C7.1 20.8,19.8 21.2,19.4 v21.6,19.4
  Bottom 0.254: v27,24.7 v21.6,19.4
N$11  (via drill 0.38)
  Top 0.254: R12.1 v33,36.2
  Bottom 0.254: v33,36.2 33,36.4 35.7,39.1 36.6,39.1 38,40.5 38.48,40.5 VR1.3
N$14  (via drill 0.38)
  Top 0.254: U4.4 33.73,33.88 R11.2 34.05,35.05 33.7,35.4 32.2,35.4 v31.2,36.4 | v31.2,39.3 33.5,39.3 35.2,41
  Top 0.508: VR1.1 37.1,47.44 VR1.2 35.2,44.86 35.2,41
  Bottom 0.254: v31.2,36.4 v31.2,39.3
N$16
  Top 0.254: U1.1 10.15,36.9 LED1.C
N$17  (via drill 0.38)
  Top 0.254: Q1.B 21.65,25.65 v21.7,25.7 | v24.7,30.4 C12.2 | R17.2 29.15,28.75 v29.7,28 | R14.2 27.25,38.35 27.2,38.4 TP5.P$1
  Top 0.305: v28,38.4 27.2,38.4
  Top 0.406: R17.2 26.15,28.75 25.8,29.1 24.75,29.1 C12.2
  Bottom 0.254: v21.7,25.7 21.6,25.5 v24.7,30.4
  Bottom 0.305: v29.7,28 29.7,31.1 28.2,32.4 v28,38.4
N$18
  Top 0.406: R18.1 22.05,28.75 21.2,27.6 19.85,27.6 Q1.E
N$19
  Top 0.813: F1.2 D1.C | S1.2 12.45,3.75 12,4.1 10.9,5.1
  Top 1.422: 10.9,5.1 8.4,7.6 D1.C
N$20
  Top 0.254: C1.1 15.1,37 13.95,37 U1.5
N$21
  Top 0.254: R20.2 24.65,31.85 24.1,31.3 23.03,31.3 U5.4 22.99,29.89 22.7,29.6 R16.1
N$22
  Top 0.406: VR2.3 14.62,42.34 C14.1
N$23
  Top 0.254: LED3.A R13.2
N$24
  Top 0.254: Q1.C 17.9,28.1 17,29.05 16.67,29.35 | 16.67,29.35 16.38,29.62 | 16.38,29.62 R15.1 18.65,30.85 C11.2 19.4,31 19.6,31.2 20.55,31.2 U5.3 | R19.2 16.5,33.4 14.2,33.4 14.2,31.8 16.38,29.62 | TP6.P$1 15.42,28.1 16.67,29.35
N$26
  Top 0.254: R1.1 LED1.A
N$27
  Top 1.27: R8.2 TP1.P$1
N$30
  Top 0.254: R2.1 LED2.A
VCC  (via drill 0.38)
  Top 0.254: C13.2 27.7,30.6 27.5,30.4 27.6,30.35 R21.1 28.15,30.3 v28.8,30.5 | C13.2 30,31.9 30.3,31.6 C10.2 32.44,31.26 U4.5 33.73,30.47 C3.2 | R17.1 28.35,27.45 v28.8,27 29.05,26.7 R7.2 | U5.5 24.05,34.2 v24.4,34.2 | v26.4,34.2 26.8,34.1 26.8,32.1 27,31.9 C13.2 | R2.2 3.65,37.05
  Top 0.305: R1.2 3.65,37.05 | C5.2 23.6,24.46 U3.5
  Top 0.406: v17.8,23.6 17.8,24.1 18.3,24.6 22.4,24.6 22.7,24.3 U3.5 | C5.2 23.4,25.9 22.7,26.6 R18.2 23.65,27.55 23.8,27.4 24.65,27.4 C12.1 26.4,27.35 R17.1
  Top 0.61: U1.2 3.8,35.9 3.7,36 3.7,36.85 R1.2
  Top 0.813: S1.3 9.4,4.1 6.4,7.1 6.4,11.3 6.4,11.51 | 6.4,11.51 C2.1 6.45,16.85 7.2,17.6 v15.9,17.6 | 3.65,37.05 2.75,37.05 2.1,36.4 2.1,12.6 3,11.7 6.22,11.7 6.4,11.51
  Bottom 0.254: v28.8,30.5 v28.8,27 | v24.4,34.2 v26.4,34.2
  Bottom 0.61: 15.9,21.9 v17.8,23.6
  Bottom 0.75: v15.9,17.6 15.9,21.9
VIN  (via drill 0.38)
  Top 0.254: R3.1 v32.3,25.4 | R5.1 33.85,20.35 v33.8,20.3
  Top 0.305: C4.1 35.45,22.2 R4.2 34.75,22.15 34.6,22 R5.1
  Top 0.813: v38,22.2 C4.1
  Bottom 0.254: v32.3,25.4 33.8,24.1 v33.8,20.3
  Bottom 0.813: J2.P$1 45.72,18.28 41.8,22.2 v38,22.2
VOUT_COMP  (via drill 0.38)
  Top 0.254: R21.2 26.25,32.95 26.1,33.1 25.45,33.1 R20.1 25.4,35.1 24.7,35.8 D5.C 22.7,35.8 | 22.7,35.8 20.5,33.6 20.5,33.25 U5.1 | 22.7,35.8 v21.5,37
  Top 0.508: VR2.2 12,47.4 VR2.1
  Bottom 0.406: v21.5,37 19.8,38.7 19.8,44.2 16.56,47.44 VR2.1
VOUT_DRIVE  (via drill 0.38)
  Top 0.254: U4.1 36.53,31.2 38.1,31.2 38.8,31.9 38.8,35.8 38.4,36.2 R12.2 35.75,37.65 35.4,38 v30.3,38 30.25,38 R14.1 | R13.1 v3.6,33.7
  Top 0.305: v4.4,39.9 7.7,43.2 7.7,47.3 9.3,48.9 29.4,48.9 v30.3,47.9
  Bottom 0.254: v30.3,38 30.3,40.25
  Bottom 0.305: v3.6,33.7 4.1,35 4.4,35.3 v4.4,39.9 | v30.3,47.9 30.3,40.25
VOUTA
  Top 0.406: U3.1 22.75,21.7 R9.2 20.85,22.15 C7.2 20.75,22.15 R10.1
VOUTB  (via drill 0.38)
  Top 0.254: U4.3 36.5,33.17 36.5,33.7 37,34.2 v37,34.3 | v10.9,38.3 11.4,37.8 23.7,37.8 26.4,35.1 v30.3,35.1
  Top 0.305: D4.C 18.05,22.1 C9.1 19.45,22.15 R10.2
  Top 0.508: D4.C 17.65,22.5 15.8,22.5 13.3,25 J3.S v10.9,33.6
  Bottom 0.254: v37,34.3 36.2,35.1 v30.3,35.1 | v10.9,38.3 v10.9,33.6
VREF
  Top 0.25: U2.1 33.41,27.04 R3.2 R7.1 | U2.2 U2.1 | C8.1 34.5,27.13 U2.1
  Top 0.254: R7.1 30.8,28 30.5,28.2 30.5,29.05 D6.C

### Text on the board
tNames: ON/OFF
bNames: MilliToney | CAD A | MVW | GUVVY.CO.UK